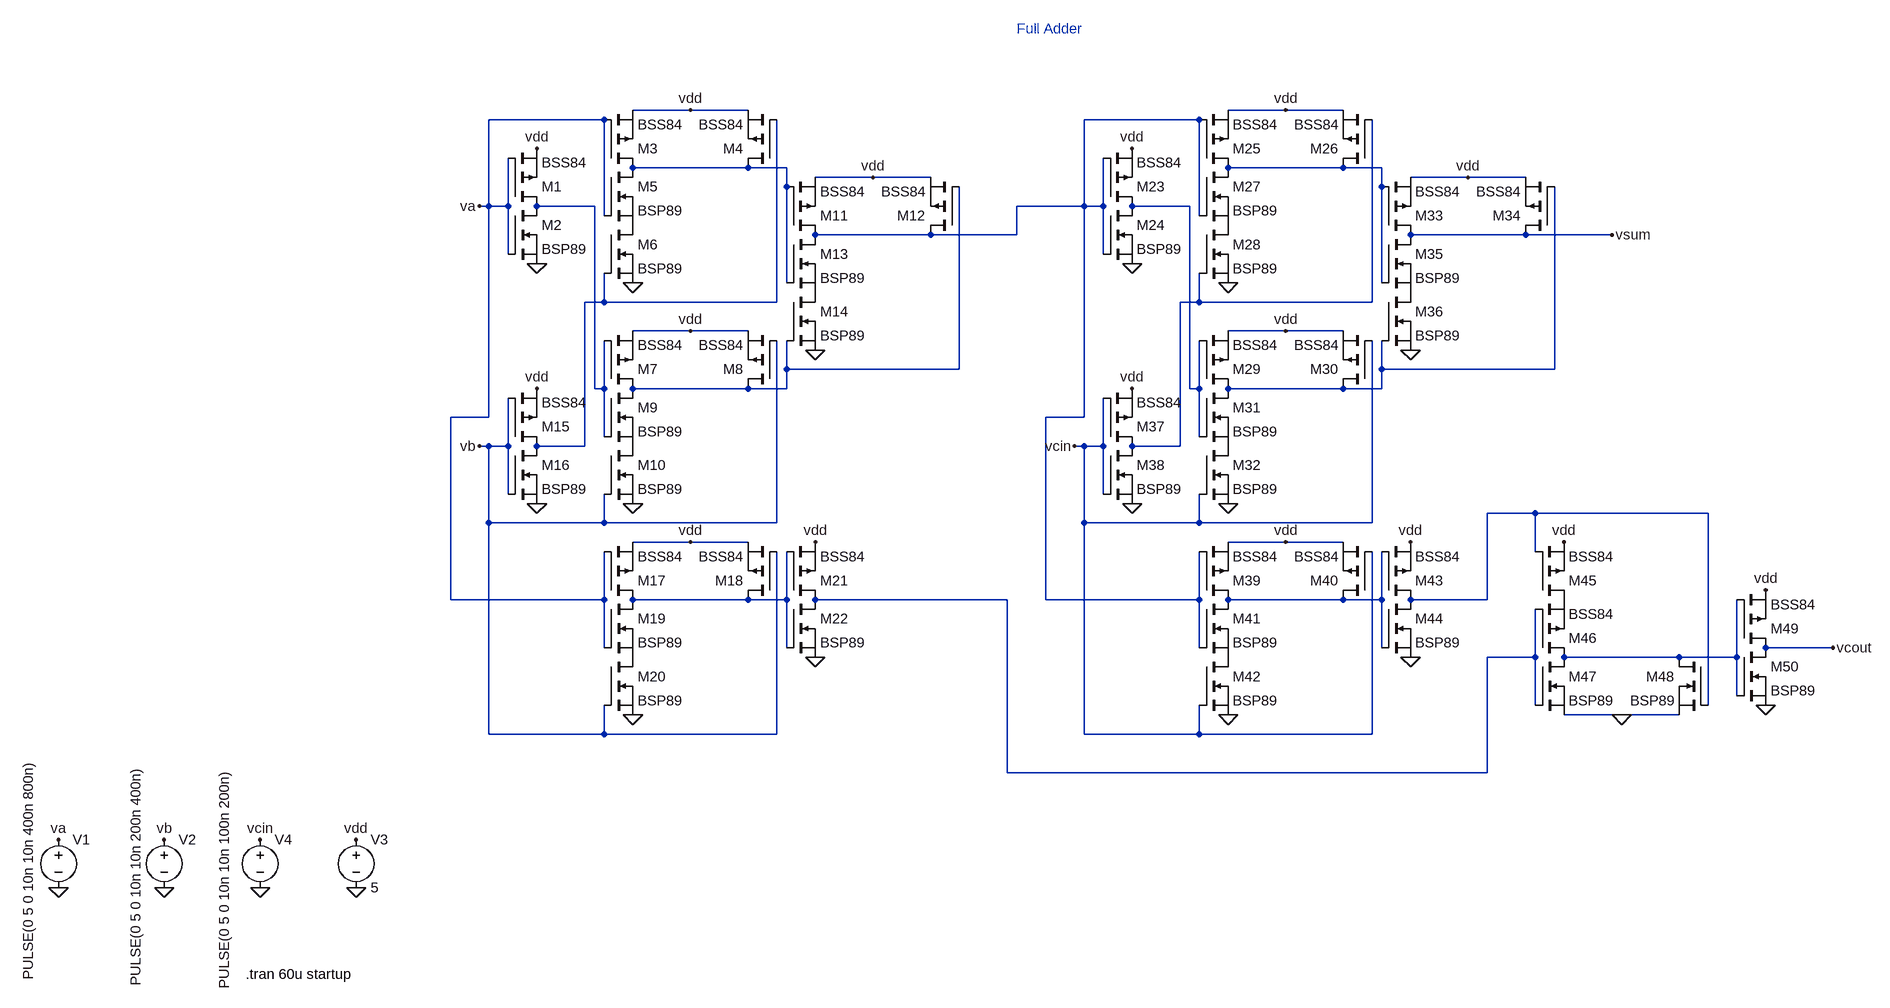
[diagram p0: schematic Full Adder.asc]
Full Adder.asc, the LTspice schematic file:
Version 4.1
SHEET 1 3664 1280
WIRE 1680 -208 1584 -208
WIRE 1776 -208 1680 -208
WIRE 2672 -208 2576 -208
WIRE 2768 -208 2672 -208
WIRE 1536 -192 1344 -192
WIRE 2528 -192 2336 -192
WIRE 1776 -112 1584 -112
WIRE 1840 -112 1776 -112
WIRE 2768 -112 2576 -112
WIRE 2832 -112 2768 -112
WIRE 1984 -96 1888 -96
WIRE 2080 -96 1984 -96
WIRE 2976 -96 2880 -96
WIRE 3072 -96 2976 -96
WIRE 1840 -80 1840 -112
WIRE 2832 -80 2832 -112
WIRE 1344 -48 1344 -192
WIRE 1344 -48 1328 -48
WIRE 1376 -48 1376 -128
WIRE 1376 -48 1344 -48
WIRE 1520 -48 1424 -48
WIRE 2336 -48 2336 -192
WIRE 2336 -48 2224 -48
WIRE 2368 -48 2368 -128
WIRE 2368 -48 2336 -48
WIRE 2512 -48 2416 -48
WIRE 1536 -32 1536 -192
WIRE 2528 -32 2528 -192
WIRE 2080 0 1888 0
WIRE 2224 0 2224 -48
WIRE 2224 0 2080 0
WIRE 3072 0 2880 0
WIRE 3216 0 3072 0
WIRE 1376 32 1376 -48
WIRE 2368 32 2368 -48
WIRE 1840 80 1840 -80
WIRE 2832 80 2832 -80
WIRE 1536 112 1536 64
WIRE 1536 112 1504 112
WIRE 1824 112 1824 -192
WIRE 1824 112 1536 112
WIRE 2528 112 2528 64
WIRE 2528 112 2496 112
WIRE 2816 112 2816 -192
WIRE 2816 112 2528 112
WIRE 1680 160 1584 160
WIRE 1776 160 1680 160
WIRE 2672 160 2576 160
WIRE 2768 160 2672 160
WIRE 1840 224 1840 176
WIRE 2128 224 2128 -80
WIRE 2128 224 1840 224
WIRE 2832 224 2832 176
WIRE 3120 224 3120 -80
WIRE 3120 224 2832 224
WIRE 1520 256 1520 -48
WIRE 1536 256 1536 176
WIRE 1536 256 1520 256
WIRE 1776 256 1584 256
WIRE 1840 256 1840 224
WIRE 1840 256 1776 256
WIRE 2512 256 2512 -48
WIRE 2528 256 2528 176
WIRE 2528 256 2512 256
WIRE 2768 256 2576 256
WIRE 2832 256 2832 224
WIRE 2832 256 2768 256
WIRE 1344 304 1344 -48
WIRE 1344 304 1280 304
WIRE 2336 304 2336 -48
WIRE 2336 304 2272 304
WIRE 1536 336 1536 256
WIRE 2528 336 2528 256
WIRE 1344 352 1328 352
WIRE 1376 352 1376 272
WIRE 1376 352 1344 352
WIRE 1504 352 1504 112
WIRE 1504 352 1424 352
WIRE 2336 352 2320 352
WIRE 2368 352 2368 272
WIRE 2368 352 2336 352
WIRE 2496 352 2496 112
WIRE 2496 352 2416 352
WIRE 1376 432 1376 352
WIRE 2368 432 2368 352
WIRE 3088 464 3008 464
WIRE 3376 464 3088 464
WIRE 1344 480 1344 352
WIRE 1536 480 1536 432
WIRE 1536 480 1344 480
WIRE 1824 480 1824 176
WIRE 1824 480 1536 480
WIRE 2336 480 2336 352
WIRE 2528 480 2528 432
WIRE 2528 480 2336 480
WIRE 2816 480 2816 176
WIRE 2816 480 2528 480
WIRE 1680 512 1584 512
WIRE 1776 512 1680 512
WIRE 2672 512 2576 512
WIRE 2768 512 2672 512
WIRE 3088 528 3088 464
WIRE 1280 608 1280 304
WIRE 1536 608 1536 528
WIRE 1536 608 1280 608
WIRE 1776 608 1584 608
WIRE 1840 608 1840 528
WIRE 1840 608 1776 608
WIRE 2208 608 1888 608
WIRE 2272 608 2272 304
WIRE 2528 608 2528 528
WIRE 2528 608 2272 608
WIRE 2768 608 2576 608
WIRE 2832 608 2832 528
WIRE 2832 608 2768 608
WIRE 3008 608 3008 464
WIRE 3008 608 2880 608
WIRE 1536 688 1536 608
WIRE 1840 688 1840 608
WIRE 2528 688 2528 608
WIRE 2832 688 2832 608
WIRE 3584 688 3472 688
WIRE 3088 704 3088 624
WIRE 3088 704 3008 704
WIRE 3328 704 3136 704
WIRE 3424 704 3424 608
WIRE 3424 704 3328 704
WIRE 3424 768 3424 704
WIRE 3088 784 3088 704
WIRE 3376 784 3376 464
WIRE 3232 800 3136 800
WIRE 3328 800 3232 800
WIRE 1344 832 1344 480
WIRE 1536 832 1536 784
WIRE 1536 832 1344 832
WIRE 1824 832 1824 528
WIRE 1824 832 1536 832
WIRE 2336 832 2336 480
WIRE 2528 832 2528 784
WIRE 2528 832 2336 832
WIRE 2816 832 2816 528
WIRE 2816 832 2528 832
WIRE 2208 896 2208 608
WIRE 3008 896 3008 704
WIRE 3008 896 2208 896
FLAG 1424 48 0
FLAG 1424 -144 vdd
FLAG 1584 80 0
FLAG 1680 -208 vdd
FLAG 1584 448 0
FLAG 1680 160 vdd
FLAG 1888 192 0
FLAG 1984 -96 vdd
FLAG 1424 448 0
FLAG 1424 256 vdd
FLAG 1328 -48 va
FLAG 1328 352 vb
FLAG -160 1088 0
FLAG 16 1088 0
FLAG 336 1088 0
FLAG 336 1008 vdd
FLAG -160 1008 va
FLAG 16 1008 vb
FLAG 1584 800 0
FLAG 1680 512 vdd
FLAG 1888 704 0
FLAG 1888 512 vdd
FLAG 2416 48 0
FLAG 2416 -144 vdd
FLAG 2576 80 0
FLAG 2672 -208 vdd
FLAG 2576 448 0
FLAG 2672 160 vdd
FLAG 2880 192 0
FLAG 2976 -96 vdd
FLAG 2416 448 0
FLAG 2416 256 vdd
FLAG 2576 800 0
FLAG 2672 512 vdd
FLAG 2880 704 0
FLAG 2880 512 vdd
FLAG 2320 352 vcin
FLAG 3216 0 vsum
FLAG 3232 800 0
FLAG 3136 512 vdd
FLAG 176 1088 0
FLAG 176 1008 vcin
FLAG 3472 784 0
FLAG 3472 592 vdd
FLAG 3584 688 vcout
SYMBOL pmos 1376 -48 M180
SYMATTR InstName M1
SYMATTR Value BSS84
SYMBOL nmos 1376 -48 R0
SYMATTR InstName M2
SYMATTR Value BSP89
SYMBOL pmos 1536 -112 M180
SYMATTR InstName M3
SYMATTR Value BSS84
SYMBOL pmos 1824 -112 R180
SYMATTR InstName M4
SYMATTR Value BSS84
SYMBOL nmos 1536 -112 R0
SYMATTR InstName M5
SYMATTR Value BSP89
SYMBOL nmos 1536 -16 R0
SYMATTR InstName M6
SYMATTR Value BSP89
SYMBOL pmos 1536 256 M180
SYMATTR InstName M7
SYMATTR Value BSS84
SYMBOL pmos 1824 256 R180
SYMATTR InstName M8
SYMATTR Value BSS84
SYMBOL nmos 1536 256 R0
SYMATTR InstName M9
SYMATTR Value BSP89
SYMBOL nmos 1536 352 R0
SYMATTR InstName M10
SYMATTR Value BSP89
SYMBOL pmos 1840 0 M180
SYMATTR InstName M11
SYMATTR Value BSS84
SYMBOL pmos 2128 0 R180
SYMATTR InstName M12
SYMATTR Value BSS84
SYMBOL nmos 1840 0 R0
SYMATTR InstName M13
SYMATTR Value BSP89
SYMBOL nmos 1840 96 R0
SYMATTR InstName M14
SYMATTR Value BSP89
SYMBOL pmos 1376 352 M180
SYMATTR InstName M15
SYMATTR Value BSS84
SYMBOL nmos 1376 352 R0
SYMATTR InstName M16
SYMATTR Value BSP89
SYMBOL voltage -160 992 R0
WINDOW 3 -50 -115 VRight 2
WINDOW 123 0 0 Left 0
WINDOW 39 0 0 Left 0
SYMATTR InstName V1
SYMATTR Value PULSE(0 5 0 10n 10n 400n 800n)
SYMBOL voltage 16 992 R0
WINDOW 3 -47 -105 VRight 2
WINDOW 123 0 0 Left 0
WINDOW 39 0 0 Left 0
SYMATTR InstName V2
SYMATTR Value PULSE(0 5 0 10n 10n 200n 400n)
SYMBOL voltage 336 992 R0
WINDOW 123 0 0 Left 0
WINDOW 39 0 0 Left 0
SYMATTR InstName V3
SYMATTR Value 5
SYMBOL pmos 1536 608 M180
SYMATTR InstName M17
SYMATTR Value BSS84
SYMBOL pmos 1824 608 R180
SYMATTR InstName M18
SYMATTR Value BSS84
SYMBOL nmos 1536 608 R0
SYMATTR InstName M19
SYMATTR Value BSP89
SYMBOL nmos 1536 704 R0
SYMATTR InstName M20
SYMATTR Value BSP89
SYMBOL pmos 1840 608 M180
SYMATTR InstName M21
SYMATTR Value BSS84
SYMBOL nmos 1840 608 R0
SYMATTR InstName M22
SYMATTR Value BSP89
SYMBOL pmos 2368 -48 M180
SYMATTR InstName M23
SYMATTR Value BSS84
SYMBOL nmos 2368 -48 R0
SYMATTR InstName M24
SYMATTR Value BSP89
SYMBOL pmos 2528 -112 M180
SYMATTR InstName M25
SYMATTR Value BSS84
SYMBOL pmos 2816 -112 R180
SYMATTR InstName M26
SYMATTR Value BSS84
SYMBOL nmos 2528 -112 R0
SYMATTR InstName M27
SYMATTR Value BSP89
SYMBOL nmos 2528 -16 R0
SYMATTR InstName M28
SYMATTR Value BSP89
SYMBOL pmos 2528 256 M180
SYMATTR InstName M29
SYMATTR Value BSS84
SYMBOL pmos 2816 256 R180
SYMATTR InstName M30
SYMATTR Value BSS84
SYMBOL nmos 2528 256 R0
SYMATTR InstName M31
SYMATTR Value BSP89
SYMBOL nmos 2528 352 R0
SYMATTR InstName M32
SYMATTR Value BSP89
SYMBOL pmos 2832 0 M180
SYMATTR InstName M33
SYMATTR Value BSS84
SYMBOL pmos 3120 0 R180
SYMATTR InstName M34
SYMATTR Value BSS84
SYMBOL nmos 2832 0 R0
SYMATTR InstName M35
SYMATTR Value BSP89
SYMBOL nmos 2832 96 R0
SYMATTR InstName M36
SYMATTR Value BSP89
SYMBOL pmos 2368 352 M180
SYMATTR InstName M37
SYMATTR Value BSS84
SYMBOL nmos 2368 352 R0
SYMATTR InstName M38
SYMATTR Value BSP89
SYMBOL pmos 2528 608 M180
SYMATTR InstName M39
SYMATTR Value BSS84
SYMBOL pmos 2816 608 R180
SYMATTR InstName M40
SYMATTR Value BSS84
SYMBOL nmos 2528 608 R0
SYMATTR InstName M41
SYMATTR Value BSP89
SYMBOL nmos 2528 704 R0
SYMATTR InstName M42
SYMATTR Value BSP89
SYMBOL pmos 2832 608 M180
SYMATTR InstName M43
SYMATTR Value BSS84
SYMBOL nmos 2832 608 R0
SYMATTR InstName M44
SYMATTR Value BSP89
SYMBOL pmos 3088 608 M180
SYMATTR InstName M45
SYMATTR Value BSS84
SYMBOL pmos 3088 704 M180
SYMATTR InstName M46
SYMATTR Value BSS84
SYMBOL nmos 3088 704 R0
SYMATTR InstName M47
SYMATTR Value BSP89
SYMBOL nmos 3376 704 M0
SYMATTR InstName M48
SYMATTR Value BSP89
SYMBOL voltage 176 992 R0
WINDOW 3 -59 -100 VRight 2
WINDOW 123 0 0 Left 0
WINDOW 39 0 0 Left 0
SYMATTR InstName V4
SYMATTR Value PULSE(0 5 0 10n 10n 100n 200n)
SYMBOL pmos 3424 688 M180
SYMATTR InstName M49
SYMATTR Value BSS84
SYMBOL nmos 3424 688 R0
SYMATTR InstName M50
SYMATTR Value BSP89
TEXT 152 1232 Left 2 !.tran 60u startup
TEXT 2224 -344 Left 2 ;Full Adder

The netlist it stands for:
* Full Adder.asc
M1 N004 va vdd vdd BSS84
M2 N004 va 0 0 BSP89
M3 N002 va vdd vdd BSS84
M4 N002 N006 vdd vdd BSS84
M5 N002 va P001 P001 BSP89
M6 P001 N006 0 0 BSP89
M7 N008 N004 vdd vdd BSS84
M8 N008 vb vdd vdd BSS84
M9 N008 N004 P002 P002 BSP89
M10 P002 vb 0 0 BSP89
M11 N001 N002 vdd vdd BSS84
M12 N001 N008 vdd vdd BSS84
M13 N001 N002 P003 P003 BSP89
M14 P003 N008 0 0 BSP89
M15 N006 vb vdd vdd BSS84
M16 N006 vb 0 0 BSP89
V1 va 0 PULSE(0 5 0 10n 10n 400n 800n)
V2 vb 0 PULSE(0 5 0 10n 10n 200n 400n)
V3 vdd 0 5
M17 N011 va vdd vdd BSS84
M18 N011 vb vdd vdd BSS84
M19 N011 va P004 P004 BSP89
M20 P004 vb 0 0 BSP89
M21 N012 N011 vdd vdd BSS84
M22 N012 N011 0 0 BSP89
M23 N005 N001 vdd vdd BSS84
M24 N005 N001 0 0 BSP89
M25 N003 N001 vdd vdd BSS84
M26 N003 N007 vdd vdd BSS84
M27 N003 N001 P005 P005 BSP89
M28 P005 N007 0 0 BSP89
M29 N009 N005 vdd vdd BSS84
M30 N009 vcin vdd vdd BSS84
M31 N009 N005 P006 P006 BSP89
M32 P006 vcin 0 0 BSP89
M33 vsum N003 vdd vdd BSS84
M34 vsum N009 vdd vdd BSS84
M35 vsum N003 P007 P007 BSP89
M36 P007 N009 0 0 BSP89
M37 N007 vcin vdd vdd BSS84
M38 N007 vcin 0 0 BSP89
M39 N013 N001 vdd vdd BSS84
M40 N013 vcin vdd vdd BSS84
M41 N013 N001 P008 P008 BSP89
M42 P008 vcin 0 0 BSP89
M43 N010 N013 vdd vdd BSS84
M44 N010 N013 0 0 BSP89
M45 P009 N010 vdd vdd BSS84
M46 N014 N012 P009 P009 BSS84
M47 N014 N012 0 0 BSP89
M48 N014 N010 0 0 BSP89
V4 vcin 0 PULSE(0 5 0 10n 10n 100n 200n)
M49 vcout N014 vdd vdd BSS84
M50 vcout N014 0 0 BSP89
.model NMOS NMOS
.model PMOS PMOS
.lib standard.mos
.tran 60u startup
* Full Adder
.backanno
.end